# Altium schematic sheet MCU.SchDoc
size A2; SheetNumber: 5; SheetTotal: 5; SPICEModelCacheQAHRCPJZ: <root> / <DocumentId>QAHRCPJZ</DocumentId> / </root>
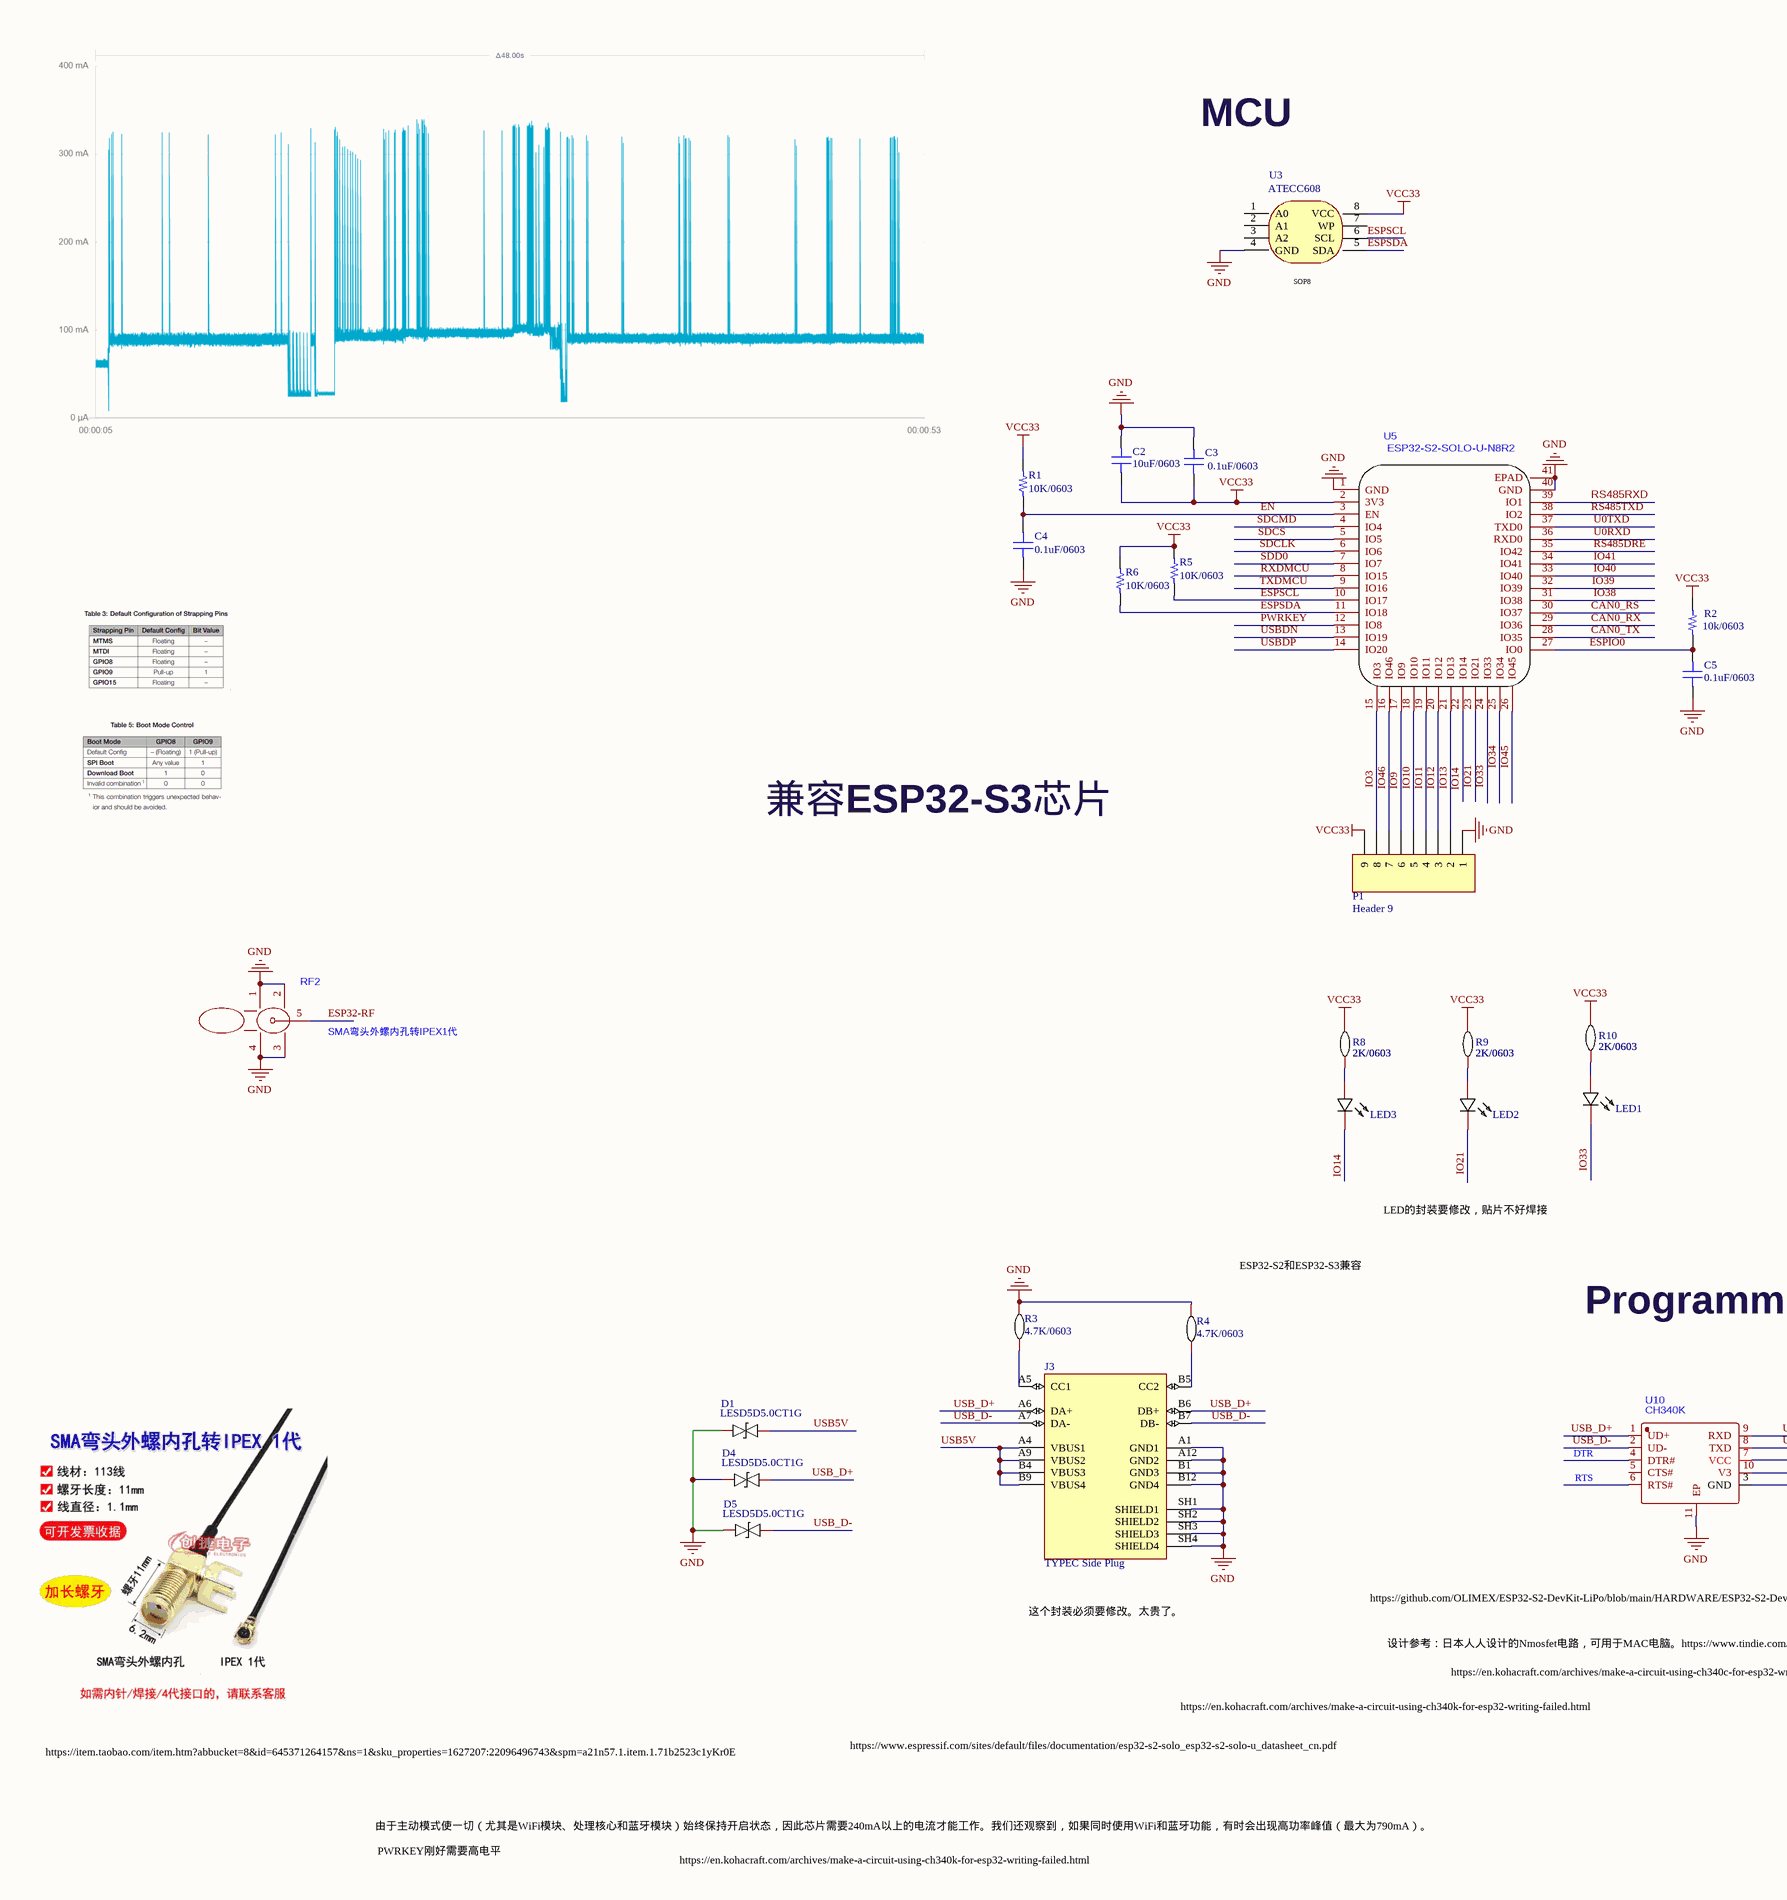
[diagram p0: MCU.SchDoc, left]
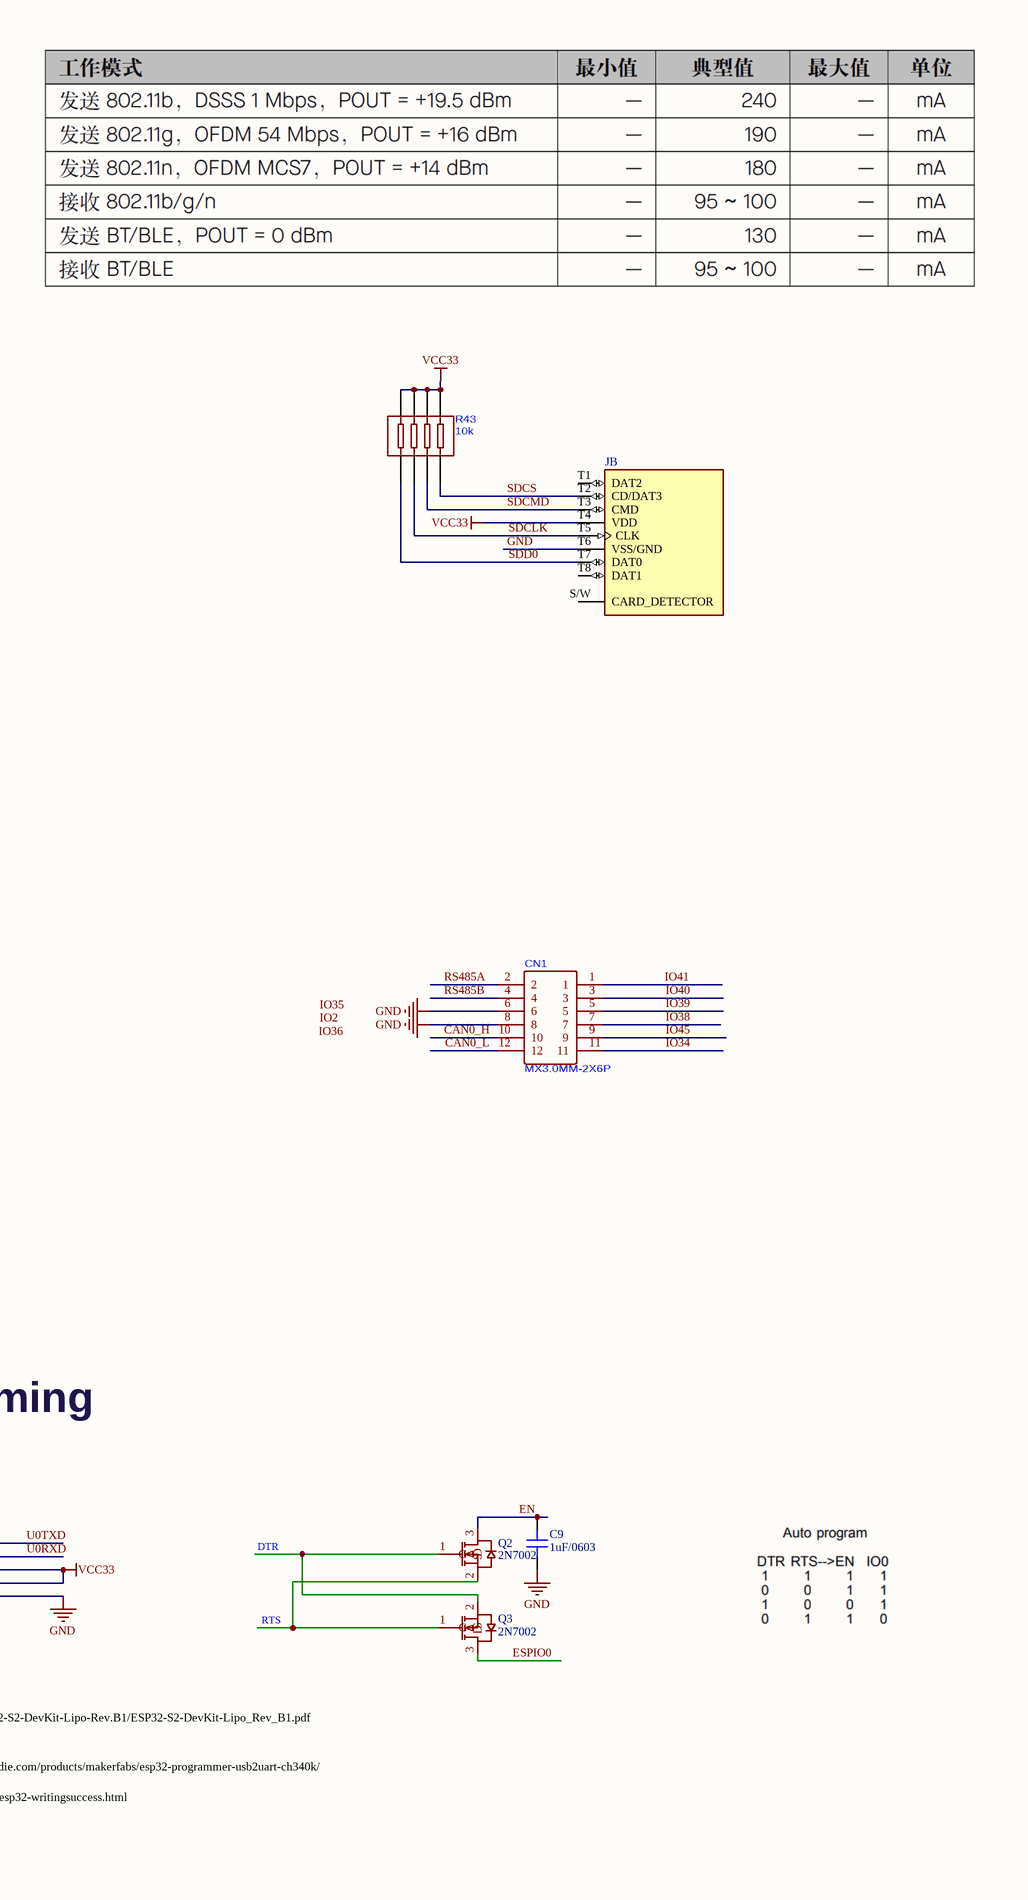
[diagram p1: MCU.SchDoc, right]

## Parts
C2  10uF/0603  [CAP0603]
C3  0.1uF/0603  [CAp0603]
C4  0.1uF/0603  [CAP0603]
C5  0.1uF/0603  [CAP0603]
C9  1uF/0603  [CAP0603]
CN1  MX3.0MM-2X6P  [3.0MM-2X6P]
D1  LESD5D5.0CT1G  [LESD5D5.0CT1G-SOD-523]
D4  LESD5D5.0CT1G  [LESD5D5.0CT1G-SOD-523]
D5  LESD5D5.0CT1G  [LESD5D5.0CT1G-SOD-523]
J  104642-1610  [MOLEX_104642-1610]  (value not drawn)  (part B of 2)
J3  TYPEC Side Plug  [TYPE-C side plug]
LED1  0603LED-红  [LED_0603_KA]  (value not drawn)
LED2  0603LED-红  [LED_0603_KA]  (value not drawn)
LED3  0603LED-红  [LED_0603_KA]  (value not drawn)
P1  Header 9  [HDR1X9]
Q2  2N7002  [SOT-23_2N7002]
Q3  2N7002  [SOT-23_2N7002]
R1  10K/0603  [RES0603]
R2  10k/0603  [RES0603]
R3  4.7K/0603  [RES0603]
R4  4.7K/0603  [RES0603]
R5  10K/0603  [RES0603]
R6  10K/0603  [RES0603]
R8  2K/0603  [RES0603]
R9  2K/0603  [RES0603]
R10  2K/0603  [RES0603]
R43  10k  [RES-ARRAY-SMD_8P-L3.2-W1.6-P0.80-BL]
RF2  SMA弯头外螺内孔转IPEX1代  [SMA-TH_BWSMA-KWE-Z001]
U3  ATECC608  [SOIC127P600X175-8N - duplicate]
U5  ESP32-S2-SOLO-U-N8R2  [ESP32-S2-SOLO-U]
U10  CH340K  [ESOP-10_L4.9-W3.9-P1.00-LS6.2-BL-EP CH340K]

## Nets
GND: C2.1 C3.1 C4.1 C5.1 C9.1 CN1.6 CN1.8 D1.2 D4.2 D5.2 J.T6(VSS/GND) J3.A1(GND1) J3.A12(GND2) J3.B1(GND3) J3.B12(GND4) J3.SH1(SHIELD1) J3.SH2(SHIELD2) J3.SH3(SHIELD3) J3.SH4(SHIELD4) P1.1 R3.1 R4.1 RF2.1 RF2.2 RF2.3 RF2.4 U3.4(GND) U5.1(GND) U5.40(GND) U5.41(EPAD) U10.3(GND) U10.11(EP)
VCC33: C2.2 C3.2 J.T4(VDD) P1.9 R1.2 R2.2 R5.2 R6.2 R8.1 R9.1 R10.1 R43.5 R43.6 R43.7 R43.8 U3.8(VCC) U5.2(3V3) U10.7(VCC) U10.10(V3)
CAN0_H: CN1.10
CAN0_L: CN1.12
CAN0_RS: U5.30(IO37)
CAN0_RX: U5.29(IO36)
CAN0_TX: U5.28(IO35)
DTR: Q2.1(G) Q3.2(S) U10.4(DTR#)
EN: C4.2 C9.2 Q2.3(D) R1.1 U5.3(EN)
ESP32-RF: RF2.5
ESPIO0: C5.2 Q3.3(D) R2.1 U5.27(IO0)
ESPSCL: R5.1 U3.6(SCL) U5.10(IO17)
ESPSDA: R6.1 U3.5(SDA) U5.11(IO18)
IO3: P1.8 U5.15(IO3)
IO9: P1.6 U5.17(IO9)
IO10: P1.5 U5.18(IO10)
IO11: P1.4 U5.19(IO11)
IO12: P1.3 U5.20(IO12)
IO13: P1.2 U5.21(IO13)
IO14: LED3.2(C) U5.22(IO14)
IO21: LED2.2(C) U5.23(IO21)
IO33: LED1.2(C) U5.24(IO33)
IO34: CN1.11 U5.25(IO34)
IO38: CN1.7 U5.31(IO38)
IO39: CN1.5 U5.32(IO39)
IO40: CN1.3 U5.33(IO40)
IO41: CN1.1 U5.34(IO41)
IO45: CN1.9 U5.26(IO45)
IO46: P1.7 U5.16(IO46)
PWRKEY: U5.12(IO8)
RS485A: CN1.2
RS485B: CN1.4
RS485DRE: U5.35(IO42)
RS485RXD: U5.39(IO1)
RS485TXD: U5.38(IO2)
RTS: Q2.2(S) Q3.1(G) U10.6(RTS#)
RXDMCU: U5.8(IO15)
SDCLK: J.T5(CLK) R43.3 U5.6(IO6)
SDCMD: J.T3(CMD) R43.2 U5.4(IO4)
SDCS: J.T2(CD/DAT3) R43.1 U5.5(IO5)
SDD0: J.T7(DAT0) R43.4 U5.7(IO7)
TXDMCU: U5.9(IO16)
U0RXD: U5.36(RXD0) U10.8(TXD)
U0TXD: U5.37(TXD0) U10.9(RXD)
USB5V: D1.1 J3.A4(VBUS1) J3.A9(VBUS2) J3.B4(VBUS3) J3.B9(VBUS4)
USB_D+: D4.1 J3.A6(DA+) J3.B6(DB+) U10.1(UD+)
USB_D-: D5.1 J3.A7(DA-) J3.B7(DB-) U10.2(UD-)
USBDN: U5.13(IO19)
USBDP: U5.14(IO20)
NetJ3_A5: J3.A5(CC1) R3.2
NetJ3_B5: J3.B5(CC2) R4.2
NetLED1_1: LED1.1(A) R10.2
NetLED2_1: LED2.1(A) R9.2
NetLED3_1: LED3.1(A) R8.2

Not connected (* = marked no-connect by the designer): J S/W(CARD_DETECTOR) T1(DAT2) T8(DAT1); U3 1(A0) 2(A1) 3(A2) 7(WP); U10 5(CTS#)

## Notes on the sheet
- MCU
- (near U3) SOP8
- 兼容ESP32-S3芯片
- ESP32-S2和ESP32-S3兼容
- LED的封装要修改，贴片不好焊接
- Programming
- 这个封装必须要修改。太贵了。
- https://github.com/OLIMEX/ESP32-S2-DevKit-LiPo/blob/main/HARDWARE/ESP32-S2-DevKit-Lipo-Rev.B1/ESP32-S2-DevKit-Lipo_Rev_B1.pdf
- 设计参考：日本人人设计的Nmosfet电路，可用于MAC电脑。https://www.tindie.com/products/makerfabs/esp32-programmer-usb2uart-ch340k/
- https://en.kohacraft.com/archives/make-a-circuit-using-ch340c-for-esp32-writingsuccess.html
- https://item.taobao.com/item.htm?abbucket=8&id=645371264157&ns=1&sku_properties=1627207:22096496743&spm=a21n57.1.item.1.71b2523c1yKr0E
- https://www.espressif.com/sites/default/files/documentation/esp32-s2-solo_esp32-s2-solo-u_datasheet_cn.pdf
- https://en.kohacraft.com/archives/make-a-circuit-using-ch340k-for-esp32-writing-failed.html
- 由于主动模式使一切（尤其是WiFi模块、处理核心和蓝牙模块）始终保持开启状态，因此芯片需要240mA以上的电流才能工作。我们还观察到，如果同时使用WiFi和蓝牙功能，有时会出现高功率峰值（最大为790mA）。
- PWRKEY刚好需要高电平
- Labels drawn without touching a wire or pin: IO2, IO35, IO36

## Library data of the parts
C2 = C0805C220J5RAC7800: CAP CER SMD 0805 22PF 5% 50V X7R; Manufacturer: KEMET; Part Number: C0805C220J5RAC7800; Value: 10uF/0603; Applications: Bypass, Decoupling; Capacitance: 22pF; ComponentLink1Description: Datasheet; ComponentLink1URL: https://api.kemet.com/component-edge/download/datasheet/C0805C220J5RAC7800.pdf; ComponentLink2Description: DigiKey Link; ComponentLink2URL: http://digikey.com/product-detail/en/kemet/C0805C220J5RAC7800/399-17625-1-ND/8572625; Device Package: 0805 (2012 Metric); LastUpdated: 02.09.2020 01:04:09; Lifecycle Status: Active; Minimum Order: 1; Mounting Type: Surface Mount, MLCC; Operating Temperature: -55°C ~ 125°C; Package / Case: 0805 (2012 Metric); Packaging: TapeAndReel; PartId: 17442; Part Status: Active; Price: 0.03; Series: SMD Comm X7R; Size / Dimension: 0.079" L x 0.049" W (2.00mm x 1.25mm); Supplier 1: DigiKey; Supplier Part Number 1: 399-17625-1-ND; Temperature Coefficient: X7R; Thickness (Max): 0.035" (0.88mm); Tolerance: ±5%; Voltage - Rated: 50V
C3 = C0805C220J5RAC7800: CAP CER SMD 0805 22PF 5% 50V X7R; Manufacturer: KEMET; Value: 0.22uF/0603; Part Number: C0805C220J5RAC7800; Applications: Bypass, Decoupling; Capacitance: 22pF; ComponentLink1Description: Datasheet; ComponentLink1URL: https://api.kemet.com/component-edge/download/datasheet/C0805C220J5RAC7800.pdf; ComponentLink2Description: DigiKey Link; ComponentLink2URL: http://digikey.com/product-detail/en/kemet/C0805C220J5RAC7800/399-17625-1-ND/8572625; Device Package: 0805 (2012 Metric); LastUpdated: 02.09.2020 01:04:09; Lifecycle Status: Active; Minimum Order: 1; Mounting Type: Surface Mount, MLCC; Operating Temperature: -55°C ~ 125°C; Package / Case: 0805 (2012 Metric); Packaging: TapeAndReel; PartId: 17442; Part Status: Active; Price: 0.03; Series: SMD Comm X7R; Size / Dimension: 0.079" L x 0.049" W (2.00mm x 1.25mm); Supplier 1: DigiKey; Supplier Part Number 1: 399-17625-1-ND; Temperature Coefficient: X7R; Thickness (Max): 0.035" (0.88mm); Tolerance: ±5%; Voltage - Rated: 50V
C4 C5 C9 = C0805C220J5RAC7800: CAP CER SMD 0805 22PF 5% 50V X7R; Manufacturer: KEMET; Value: 0.1uF; Part Number: C0805C220J5RAC7800; Applications: Bypass, Decoupling; Capacitance: 22pF; ComponentLink1Description: Datasheet; ComponentLink1URL: https://api.kemet.com/component-edge/download/datasheet/C0805C220J5RAC7800.pdf; ComponentLink2Description: DigiKey Link; ComponentLink2URL: http://digikey.com/product-detail/en/kemet/C0805C220J5RAC7800/399-17625-1-ND/8572625; Device Package: 0805 (2012 Metric); LastUpdated: 02.09.2020 01:04:09; Lifecycle Status: Active; Minimum Order: 1; Mounting Type: Surface Mount, MLCC; Operating Temperature: -55°C ~ 125°C; Package / Case: 0805 (2012 Metric); Packaging: TapeAndReel; PartId: 17442; Part Status: Active; Price: 0.03; Series: SMD Comm X7R; Size / Dimension: 0.079" L x 0.049" W (2.00mm x 1.25mm); Supplier 1: DigiKey; Supplier Part Number 1: 399-17625-1-ND; Temperature Coefficient: X7R; Thickness (Max): 0.035" (0.88mm); Tolerance: ±5%; Voltage - Rated: 50V
CN1 = A2005WR-2X6P
D1 D4 D5 = LESD5D5.0CT1G: Bi-Directional 5V SOD-523 Electrostatic and Surge Protection; Manufacturer: Leshan Radio; Convert to PCB: yes; Origin Footprint: SOD-523_L1.2-W0.8-LS1.6-BI; Name: LESD5D5.0CT1G; Symbol: LESD5D5.0CT1G; Device: LESD5D5.0CT1G; Supplier: LCSC; Supplier Part: C383211; Manufacturer Part: LESD5D5.0CT1G; JLCPCB Part Class: Extended Part; Add into BOM: yes
J = 104642-1610: 17 (16 + 1) Position Card Connector Combo - microSDâ„¢, Micro SIM Surface Mount, Right Angle Gold or Gold-Palladium; MF: Molex; Package: None; SnapEDA_Link: https://www.snapeda.com/parts/104642-1610/Molex/view-part/501052/?ref=snap; Mouser-Purchase-URL: https://snapeda.com/shop?store=Mouser&id=501052; MP: 104642-1610; Price: None; Availability: Warning; Value: *
J3 = TYPEC Side Plug: MF: {'manufacturer': u'Molex'}; MP: 2169890001; Package: None; Price: None; Value: *; Availability: Unavailable
LED1-LED3 = LED: 0603LED-红，兼容直插; Manufacturer: EVERLIGHT; Name: 19-217/GHC-YR1S2/3T; Convert to PCB: yes; Origin Footprint: LED0603-R-RD; Symbol: 19-217/GHC-YR1S2/3T; Device: 19-217/GHC-YR1S2/3T; Supplier: LCSC; Manufacturer Part: 19-217/GHC-YR1S2/3T; Supplier Part: C72043; JLCPCB Part Class: Basic Part; Add into BOM: yes
P1 = Header 9: Header, 9-Pin; LatestRevisionDate: 17-Jul-2002; LatestRevisionNote: Re-released for DXP Platform.; Publisher: Altium Limited
Q2 Q3 = 2N7002: Nmos 2N7000, 2N7002, NDS7002A
R1 R5 R6 = RPC0805JT100R-UP: RES, PULSE, 0805, 5%, 100 OHM, 0; Manufacturer: Stackpole Electronics Inc; Power (Watts): 0.5W, 1/2W; Resistance: 100 Ohms; Temperature Coefficient: ±200ppm/°C; Part Number: RPC0805JT100R-UP; ComponentLink1Description: Datasheet; ComponentLink1URL: https://www.seielect.com/catalog/sei-rpc.pdf; ComponentLink2Description: DigiKey Link; ComponentLink2URL: http://digikey.com/product-detail/en/stackpole-electronics-inc/RPC0805JT100R-UP/RPC0805JT100R-UPCT-ND/10109071; Composition: Thick Film; Device Package: 0805 (2012 Metric); Features: Automotive AEC-Q200, Pulse Withstanding; Height - Seated (Max): 0.024" (0.60mm); LastUpdated: 02.09.2020 01:15:08; Lifecycle Status: Active; Minimum Order: 1; Number of Terminations: 2; Operating Temperature: -55°C ~ 155°C; Package / Case: 0805 (2012 Metric); Packaging: TapeAndReel; PartId: 35188; Part Status: Active; Price: 0.02; Ratings: AEC-Q200; Series: RPC; Size / Dimension: 0.079" L x 0.049" W (2.00mm x 1.25mm); Supplier 1: DigiKey; Supplier Part Number 1: RPC0805JT100R-UPCT-ND; Supplier Device Package: 0805; Tolerance: ±5%
R2 = RPC0805JT100R-UP: RES, PULSE, 0805, 5%, 100 OHM, 0; Manufacturer: Stackpole Electronics Inc; Value: 10k; Power (Watts): 0.5W, 1/2W; Resistance: 100 Ohms; Temperature Coefficient: ±200ppm/°C; Part Number: RPC0805JT100R-UP; ComponentLink1Description: Datasheet; ComponentLink1URL: https://www.seielect.com/catalog/sei-rpc.pdf; ComponentLink2Description: DigiKey Link; ComponentLink2URL: http://digikey.com/product-detail/en/stackpole-electronics-inc/RPC0805JT100R-UP/RPC0805JT100R-UPCT-ND/10109071; Composition: Thick Film; Device Package: 0805 (2012 Metric); Features: Automotive AEC-Q200, Pulse Withstanding; Height - Seated (Max): 0.024" (0.60mm); LastUpdated: 02.09.2020 01:15:08; Lifecycle Status: Active; Minimum Order: 1; Number of Terminations: 2; Operating Temperature: -55°C ~ 155°C; Package / Case: 0805 (2012 Metric); Packaging: TapeAndReel; PartId: 35188; Part Status: Active; Price: 0.02; Ratings: AEC-Q200; Series: RPC; Size / Dimension: 0.079" L x 0.049" W (2.00mm x 1.25mm); Supplier 1: DigiKey; Supplier Part Number 1: RPC0805JT100R-UPCT-ND; Supplier Device Package: 0805; Tolerance: ±5%
R3 R4 = 5.1K: Manufacturer: UniOhm; Manufacturer Part: 0402WGF5101TCE; Convert to PCB: yes; Origin Footprint: R0402; Name: 5.1K; Symbol: 5.1K; Device: 5.1K; Supplier: LCSC; Supplier Part: C25905; JLCPCB Part Class: Basic Part; Add into BOM: yes
R8-R10 = 2.2K: Manufacturer: UniOhm; Manufacturer Part: 0402WGF2201TCE; Convert to PCB: yes; Origin Footprint: R0402; Name: 2K/0603; Symbol: 2.2K; Device: 2.2K; Supplier: LCSC; Supplier Part: C25879; JLCPCB Part Class: Basic Part; Add into BOM: yes
R43 = 2.2K排阻-4D03: 电阻排-4D03
RF2 = BWSMA-KWE-Z001: SMA 4脚拐弯射频天线插座，https://item.taobao.com/item.htm?abbucket=8&id=645371264157&ns=1&sku_properties=1627207:22096496743&spm=a21n57.1.item.1.71b2523c1yKr0E
U3 = 24CXX: microchip 加密芯片 IIC，SOIC封装
U5 = ESP32-S2-SOLO-U-N4: RISC-V芯片或Xtensa双核芯片,wifi+BLE.腿脚兼容ESP32-S3
U10 = CH340K: usb转串口，用于下载使用。